# EAGLE schematic dry-box-controller (EAGLE 9.6.2)
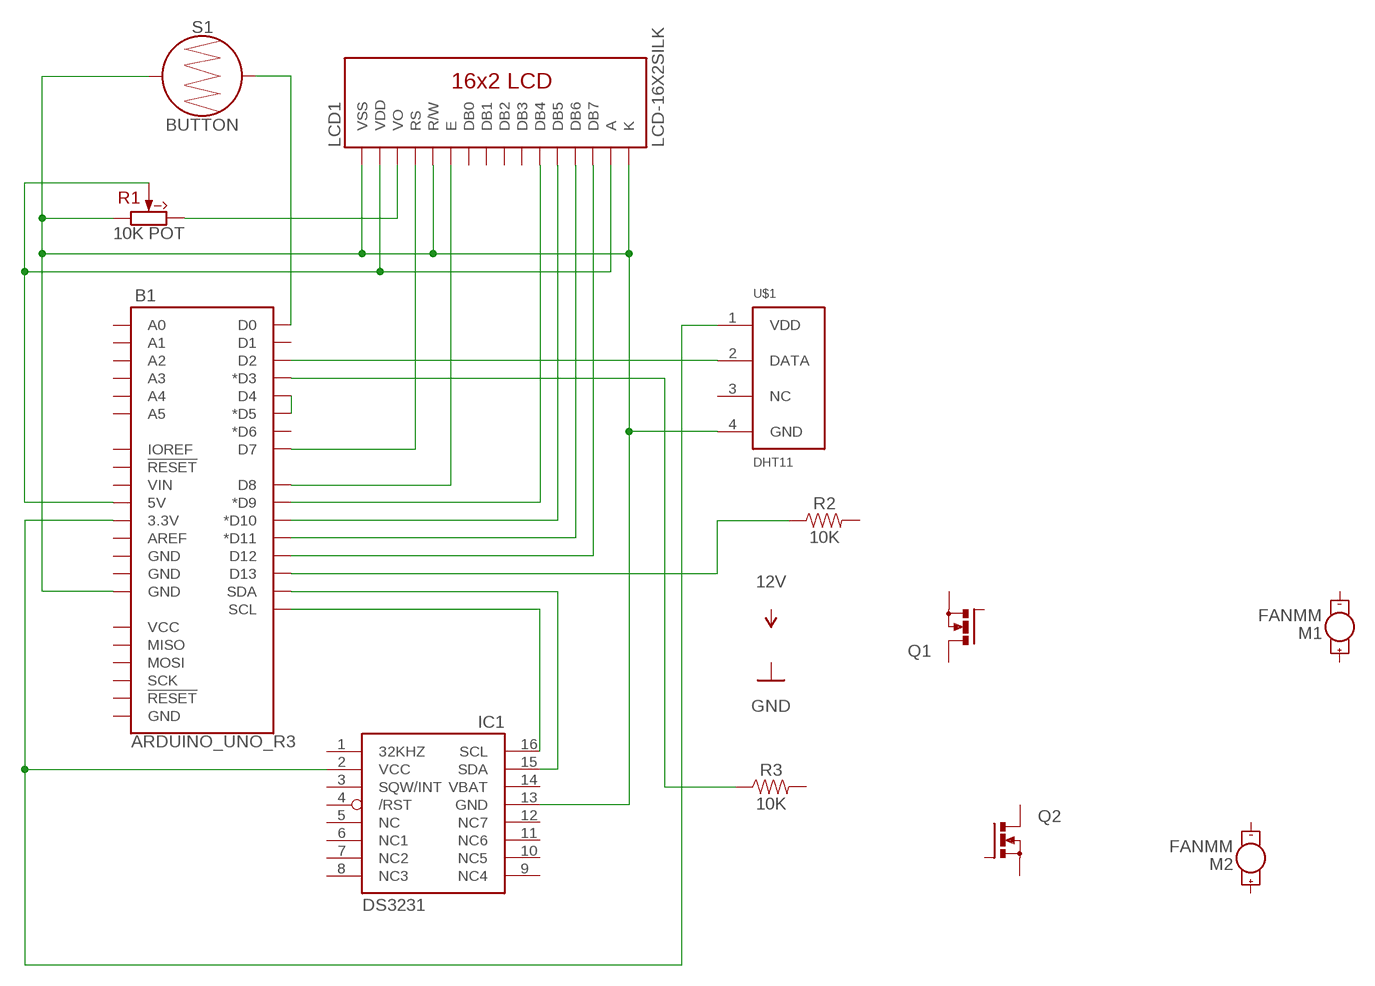
[diagram p0: schematic, sheet 1]

## Parts
B1  ARDUINO_UNO_R3  [ARDUINO_R3]
IC1  DS3231/SO  [SO16W]
LCD1  LCD-16X2SILK  [LCD-16X2]
M1  FANMM  MOTOR10MM  [VIBE-MOTOR-10MM]
M2  FANMM  MOTOR10MM  [VIBE-MOTOR-10MM]
Q1  PMOSFET_NTO220BV  [TO220BV]
Q2  PMOSFET_NTO220BV  [TO220BV]
R1  10K POT  B20K(PTD90)  [PTD901]
R2  10K  RESISTOR0402  [0402]
R3  10K  RESISTOR0402  [0402]
S1  BUTTON  BUTTON-CONDUCTIVESMD  [BUTTON-CONDUCTIVE]
U$1  DHT11  [DHT11]

## Nets
N$1: B1.3.3V IC1.2(VCC) U$1.1(VDD)
N$2: B1.GND@2(GND) IC1.13(GND) LCD1.1(VSS) LCD1.5(R/W) LCD1.16(K) R1.1(CCW) S1.1 U$1.4(GND)
N$3: B1.D10(*D10) LCD1.12(DB5)
N$4: B1.5V LCD1.2(VDD) LCD1.15(A) R1.2(W)
N$5: LCD1.3(VO) R1.3(CW)
N$6: B1.D7 LCD1.4(RS)
N$7: B1.D8 LCD1.6(E)
N$8: B1.D12 LCD1.14(DB7)
N$9: B1.D11(*D11) LCD1.13(DB6)
N$10: B1.D9(*D9) LCD1.11(DB4)
N$11: B1.SCL IC1.16(SCL)
N$12: B1.SDA IC1.15(SDA)
N$13: B1.D2 U$1.2(DATA)
N$14: B1.D0 S1.2
N$15: B1.D4 B1.D5(*D5)
N$16: B1.D3(*D3) R3.1
N$21: B1.D13 R2.1
Unconnected: B1.A0 B1.A1 B1.A2 B1.A3 B1.A4 B1.A5 B1.AREF B1.D1 B1.D6(*D6) B1.GND@1(GND) B1.GND@3(GND) B1.GND@4(GND) B1.IOREF B1.MISO B1.MOSI B1.RESET@1(!RESET!) B1.RESET@2(!RESET!) B1.SCK B1.VCC B1.VIN IC1.1(32KHZ) IC1.3(SQW/INT) IC1.4(/RST) IC1.5(NC) IC1.6(NC1) IC1.7(NC2) IC1.8(NC3) IC1.9(NC4) IC1.10(NC5) IC1.11(NC6) IC1.12(NC7) LCD1.7(DB0) LCD1.8(DB1) LCD1.9(DB2) LCD1.10(DB3) M1.+ M1.- M2.+ M2.- Q1.D Q1.G Q1.S Q2.D Q2.G Q2.S R2.2 R3.2 U$1.3(NC)

## Power pins joined to a net without a drawn wire
VBAT: IC1.14(VBAT)

## Library data of the parts
B1 = SparkFun-Boards:ARDUINO_UNO_R3: Arduino R3 Footprint with SPI header Arduino Uno R3 Compatible Footprint. Matches PCB size of the original board. SparkFun Products: SAMD21 Dev Breakout <https://www.sparkfun.com/products/13672> RedBoard <https://www.sparkfun.com/products/12757> R3 Stackable Headers <https://www.sparkfun.com/products/11417>
IC1 = DS3231:DS3231: Check prices <https://pricing.snapeda.com/parts/DS3231/Maxim%20Integrated/view-part?ref=eda>; AVAILABILITY: In Stock; DESCRIPTION: Real Time Clock (RTC) IC Clock/Calendar - I²C, 2-Wire Serial 8-SOIC (0.154, 3.90mm Width); MF: Maxim Integrated; MP: DS3231; PACKAGE: SOIC-16 Maxim Integrated; PRICE: None; PURCHASE-URL: https://pricing.snapeda.com/search/part/DS3231/?ref=eda
LCD1 = SparkFun-Displays:LCD-16X2: Standard text-only 16x2 parallel input LCD Basic 16 character by 2 line display. Typically utilizes the extremely common HD44780 parallel interface chipset SparkFun Products: Basic 16x2 Green <https://www.sparkfun.com/products/255> Basic 8x2 Green <https://www.sparkfun.com/products/11122>; SF_ID: LCD-00255
M1 M2 = SparkFun-Electromechanical:MOTOR: Motor (Single-Phase) Two-terminal, single-phase motors. SparkFun Products Vibration Motor <https://www.sparkfun.com/products/8449> (ROB-08449) Physical dimension and wire connections for this powerful vibration motor. Motor has a self adhesive backing.; PROD_ID: COMP-08572; SF_SKU: ROB-08449
Q1 Q2 = transistor-power:PMOSFET_N: Power MOSFET N-Channel
R1 = potentiometers:?(PTD90); MOUSER: 652-PTD901-2015KB203
R2 R3 = SparkFun-Resistors:RESISTOR: Generic Resistor Package
S1 = SparkFun-Switches:BUTTON-CONDUCTIVE: Conductive Button Used with rubber key pads on the Nordic Key FOB <https://www.sparkfun.com/products/retired/8602>. This one was designed and proven to work with the PolyCase Key FOB enclosures <https://www.sparkfun.com/products/retired/9377>. SparkFun Products Nordic Fob <https://www.sparkfun.com/products/retired/8602> (WRL-08602)
U$1 = dht:DHT11